# EAGLE design m2301-stereo-output (EAGLE 7.5.0)
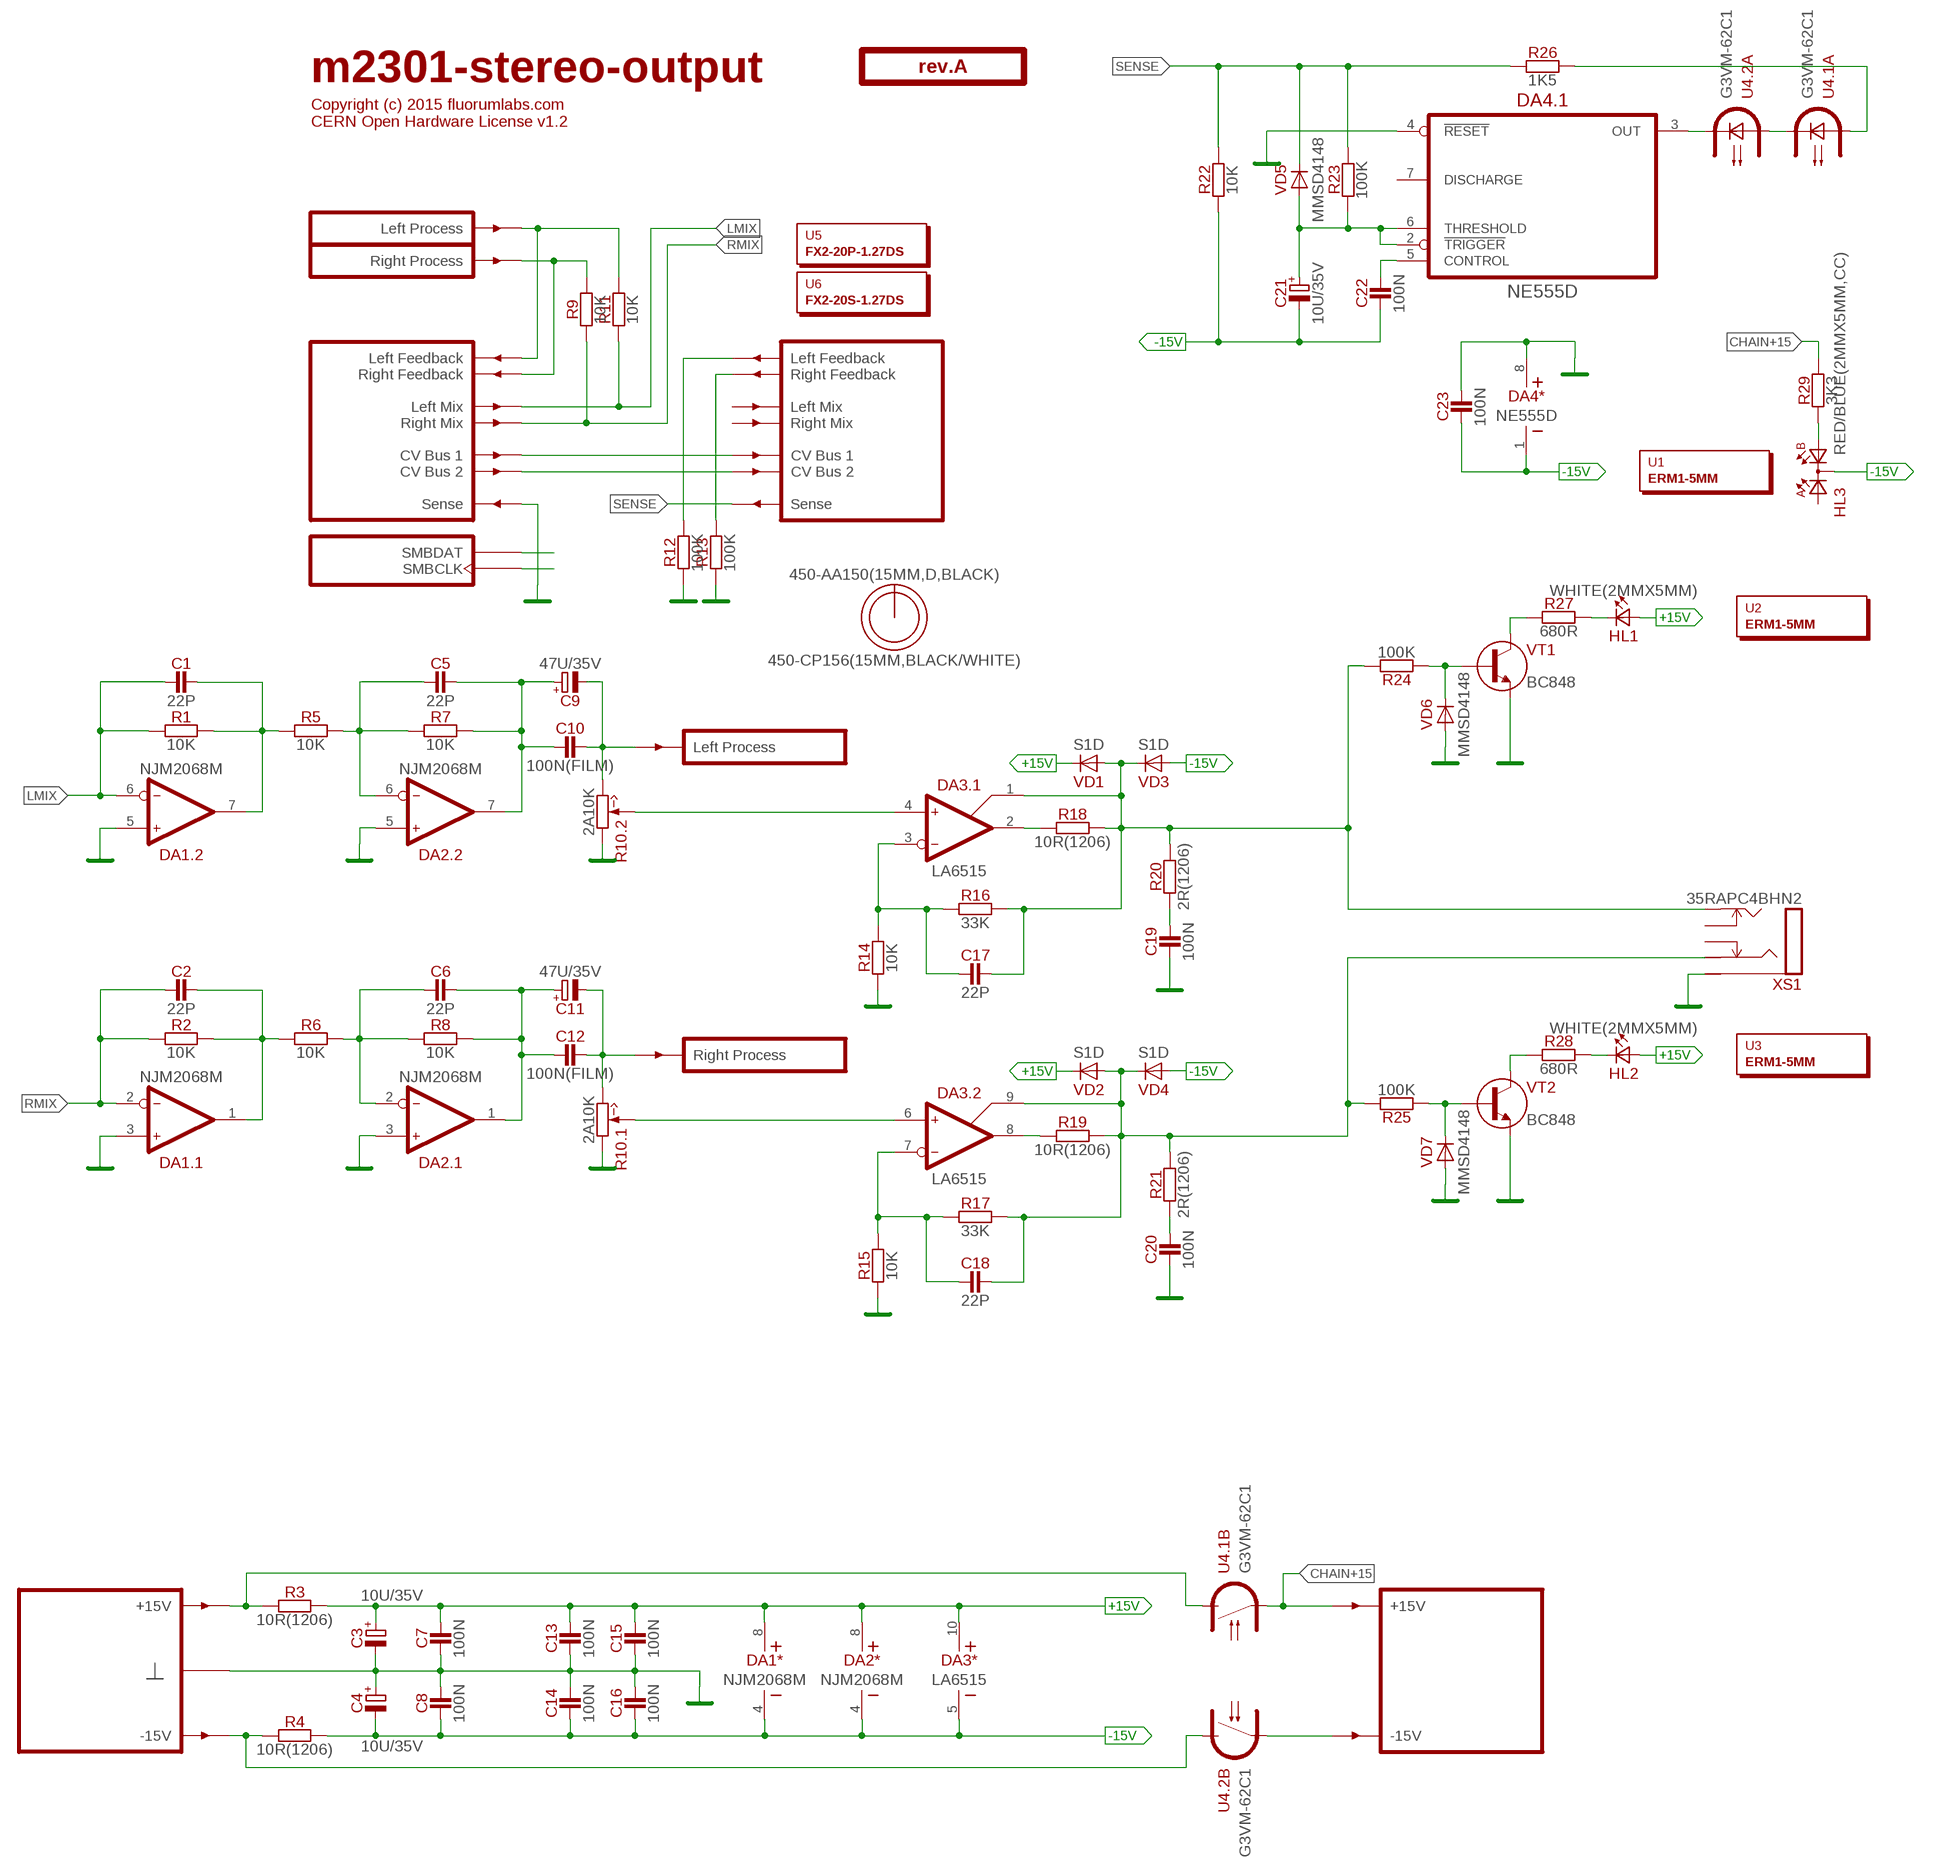
[diagram p0: schematic, sheet 1]

## Parts
C1  22P  [C-0805]
C2  22P  [C-0805]
C3  10U/35V  [E2-5]
C4  10U/35V  [E2-5]
C5  22P  [C-0805]
C6  22P  [C-0805]
C7  100N  [C-0805]
C8  100N  [C-0805]
C9  47U/35V  [E3,5-8]
C10  100N(FILM)  [C050-025X075]
C11  47U/35V  [E3,5-8]
C12  100N(FILM)  [C050-025X075]
C13  100N  [C-0805]
C14  100N  [C-0805]
C15  100N  [C-0805]
C16  100N  [C-0805]
C17  22P  [C-0805]
C18  22P  [C-0805]
C19  100N  [C-0805]
C20  100N  [C-0805]
C21  10U/35V  [E2-5]
C22  100N  [C-0805]
C23  100N  [C-0805]
DA1  NJM2068M  [SO-8]
DA2  NJM2068M  [SO-8]
DA3  LA6515  [SIL10]
DA4  NE555D  [SO-8]
HL1  WHITE(2MMX5MM)  [LED2X5]
HL2  WHITE(2MMX5MM)  [LED2X5]
HL3  RED/BLUE(2MMX5MM,CC)  [LED2X5-3PIN]
O1  TITLE  [EMPTY]
O2  450-AA150(15MM,D,BLACK)  [EMPTY]
O3  450-CP156(15MM,BLACK/WHITE)  [EMPTY]
PCB1  rev.A  ST2-BOARD-50-CHAIN  [ST2-BOARD-50]
R1  10K  [R-0805]
R2  10K  [R-0805]
R3  10R(1206)  [R-1206]
R4  10R(1206)  [R-1206]
R5  10K  [R-0805]
R6  10K  [R-0805]
R7  10K  [R-0805]
R8  10K  [R-0805]
R9  10K  [R-0805]
R10  2A10K  [RV11-DUAL]
R11  10K  [R-0805]
R12  100K  [R-0805]
R13  100K  [R-0805]
R14  10K  [R-0805]
R15  10K  [R-0805]
R16  33K  [R-0805]
R17  33K  [R-0805]
R18  10R(1206)  [R-1206]
R19  10R(1206)  [R-1206]
R20  2R(1206)  [R-1206]
R21  2R(1206)  [R-1206]
R22  10K  [R-0805]
R23  100K  [R-0805]
R24  100K  [R-0805]
R25  100K  [R-0805]
R26  1K5  [R-0805]
R27  680R  [R-0805]
R28  680R  [R-0805]
R29  3K3  [R-0805]
U1  ERM1-5MM  [EMPTY]
U2  ERM1-5MM  [EMPTY]
U3  ERM1-5MM  [EMPTY]
U4  G3VM-62C1  [DIL08]
U5  FX2-20P-1.27DS  [EMPTY]
U6  FX2-20S-1.27DS  [EMPTY]
VD1  S1D  [DO214AC]
VD2  S1D  [DO214AC]
VD3  S1D  [DO214AC]
VD4  S1D  [DO214AC]
VD5  MMSD4148  [SOD123]
VD6  MMSD4148  [SOD123]
VD7  MMSD4148  [SOD123]
VT1  BC848  [SOT23]
VT2  BC848  [SOT23]
XS1  35RAPC4BHN2  [35RAP]

## Nets
+15V [power]: C3.+ C7.2 C13.2 C15.2 DA1.8(*:V+) DA2.8(*:V+) DA3.10(*:V+) HL1.A HL2.A R3.2 VD1.C VD2.C
-15V: C4.- C8.1 C14.1 C16.1 C21.- C22.1 C23.1 DA1.4(*:V-) DA2.4(*:V-) DA3.5(*:V-) DA4.1(*:V-) HL3.K R4.2 R22.1 VD3.A VD4.A
CHAIN+15: PCB1.A+15'(P+15V) PCB1.B+15'(P+15V) R29.2 U4.7(.1B:S2)
GND: C3.- C4.+ C7.1 C8.2 C13.1 C14.2 C15.1 C16.2 C19.1 C20.1 C23.2 DA1.3(.1:IN+) DA1.5(.2:IN+) DA2.3(.1:IN+) DA2.5(.2:IN+) DA4.4(.1:!RESET) DA4.8(*:V+) PCB1.B4'(GND) PCB1.B4(GND) PCB1.B5'(GND) PCB1.B5(GND) PCB1.B6'(GND) PCB1.B6(GND) PCB1.B7'(GND) PCB1.B7(GND) PCB1.B8'(GND) PCB1.B8(GND) PCB1.BSENSE(SENSE) R10.1'(.2:CCW) R10.1(.1:CCW) R12.1 R13.1 R14.1 R15.1 VD6.A VD7.A VT1.2(E) VT2.2(E) XS1.1(S)
LMIX: C1.1 DA1.6(.2:IN-) PCB1.ALMIX(LMIX) R1.1 R11.1
N$1: PCB1.A+15(P+15V) PCB1.B+15(P+15V) R3.1 U4.8(.1B:S1)
N$2: PCB1.ARFBK'(RFBK') R13.2
N$3: DA3.6(.2:IN+) R10.2(.1:W)
N$4: PCB1.ALFBK'(LFBK') R12.2
N$5: PCB1.A-15(P-15V) PCB1.B-15(P-15V) R4.1 U4.6(.2B:S1)
N$7: C1.2 DA1.7(.2:OUT) R1.2 R5.1
N$8: C2.2 DA1.1(.1:OUT) R2.2 R6.1
N$9: DA3.4(.1:IN+) R10.2'(.2:W)
N$10: C11.- C12.2 PCB1.BOUTR'(OUTR) R10.3(.1:CW)
N$11: C17.2 DA3.1(.1:SENSE) R16.2 R18.2 R20.2 R24.2 VD1.A VD3.C XS1.2(T)
N$12: C17.1 DA3.3(.1:IN-) R14.2 R16.1
N$14: DA3.2(.1:OUT) R18.1
N$15: C9.- C10.2 PCB1.BOUTL'(OUTL) R10.3'(.2:CW)
N$16: C19.2 R20.1
N$22: C18.1 DA3.7(.2:IN-) R15.2 R17.1
N$24: C18.2 DA3.9(.2:SENSE) R17.2 R19.2 R21.2 R25.2 VD2.A VD4.C XS1.3(R)
N$27: C22.2 DA4.5(.1:CONTROL)
N$28: C21.+ DA4.2(.1:!TRIGGER) DA4.6(.1:THRESHOLD) R23.1 VD5.A
N$29: R26.2 U4.1(.1A:A)
N$30: R25.1 VD7.C VT2.1(B)
N$31: DA4.3(.1:OUT) U4.4(.2A:C)
N$32: R28.1 VT2.3(C)
N$33: HL2.K(C) R28.2
N$34: R24.1 VD6.C VT1.1(B)
N$35: R27.1 VT1.3(C)
N$36: U4.2(.1A:C) U4.3(.2A:A)
N$37: HL1.K(C) R27.2
N$38: PCB1.ASMBDAT'(SMBDAT) PCB1.ASMBDAT(SMBDAT)
N$39: PCB1.ARFBK(RFBK) PCB1.BINR(INR) R9.2
N$40: PCB1.ALFBK(LFBK) PCB1.BINL(INL) R11.2
N$41: PCB1.ACV1'(CV1') PCB1.ACV1(CV1)
N$42: PCB1.ACV2'(CV2') PCB1.ACV2(CV2)
N$43: PCB1.ASMBCLK'(SMBCLK) PCB1.ASMBCLK(SMBCLK)
N$44: HL3.A2 R29.1
N$45: DA3.8(.2:OUT) R19.1
N$46: C20.2 R21.1
N$51: PCB1.A-15'(P-15V) PCB1.B-15'(P-15V) U4.5(.2B:S2)
N$54: C5.1 DA2.6(.2:IN-) R5.2 R7.1
N$55: C5.2 C9.+ C10.1 DA2.7(.2:OUT) R7.2
N$56: C6.1 DA2.2(.1:IN-) R6.2 R8.1
N$57: C6.2 C11.+ C12.1 DA2.1(.1:OUT) R8.2
RMIX: C2.1 DA1.2(.1:IN-) PCB1.ARMIX(RMIX) R2.1 R9.1
SENSE: PCB1.BSENSE'(SENSE') R22.2 R23.2 R26.1 VD5.C
Unconnected: DA4.7(.1:DISCHARGE) HL3.A1 PCB1.ALMIX'(LMIX') PCB1.ARMIX'(RMIX') XS1.10(TN) XS1.11(RN)

## Library data of the parts
C1 C2 C5 C6 C17 C18 = capacitors:?; MOUSER: 77-VJ0805A220GXACBC
C3 C4 C21 = capacitors-electrolytic:?; MOUSER: 647-USW1V100MDD
C7 C8 C13-C16 C19 C20 C22 C23 = capacitors:?; MOUSER: 77-VJ0805V104MXBPBC
C9 C11 = capacitors-electrolytic:?; MOUSER: 647-USP1E470MDD
C10 C12 = capacitors:?; MOUSER: 505-MKS2.1/63/5
DA1 DA2 = ic-jrc:NJM2068; MOUSER: 513-NJM2068M
DA3 = ic-sanyo:LA6515
DA4 = ic-logic:NE555?; MOUSER: 595-NE555D
HL1 HL2 = optoelectronics:?(2MMX5MM)
HL3 = optoelectronics:?(2MMX5MM,CC)
O1 = text:TITLE
O2 = hardware:450-AA?; MOUSER: 450-AA150
O3 = hardware:450-C?; MOUSER: 450-CP156
PCB1 = module-footprints:ST2-BOARD-50-CHAIN
R1 R2 R5-R9 R11 R14 R15 R22 = resistors:?; MOUSER: 660-RK73H2ATTD1002F
R3 R4 R18 R19 = resistors:?; MOUSER: 660-RK73H2BTTD10R0F
R10 = potentiometers:2**?; MOUSER: 688-RK12L12C0A0E
R12 R13 R23-R25 = resistors:?; MOUSER: 660-RK73H2ATTD1003F
R16 R17 = resistors:?; MOUSER: 660-RK73H2ATTD3302F
R20 R21 = resistors:?; MOUSER: 660-RK73H2BTTD2R00F
R26 = resistors:?; MOUSER: 660-RK73H2ATTD1501F
R27 R28 = resistors:?; MOUSER: 660-RK73H2ATTD6800F
R29 = resistors:?; MOUSER: 660-RK73H2ATTD3301F
U1-U3 = hardware:?
U4 = optoelectronics:G3VM-?2C; MOUSER: 653-G3VM-62C1
U5 = hardware:?; MOUSER: 798-FX2-20P-1.27DS71
U6 = hardware:?; MOUSER: 798-FX2-20S-1.27DS71
VD1-VD4 = diodes:?; MOUSER: 625-S1DHE3
VD5-VD7 = diodes:?; MOUSER: 78-1N4148WFL-G3-08
VT1 VT2 = transistors-npn:?; MOUSER: 863-BC848BLT3G
XS1 = connectors:35RAPC4BHN2; MOUSER: 502-35RAPC4BHN2

## Board
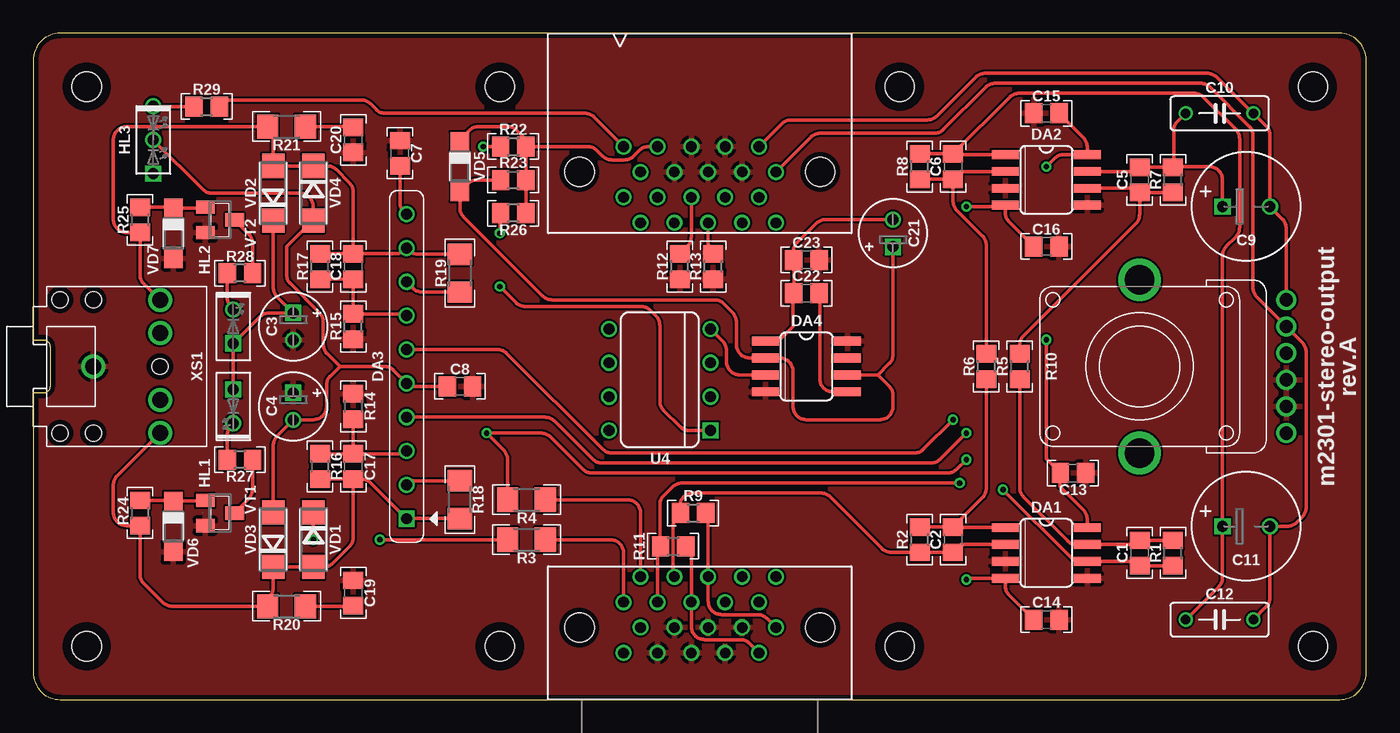
[diagram p1: board, top side]
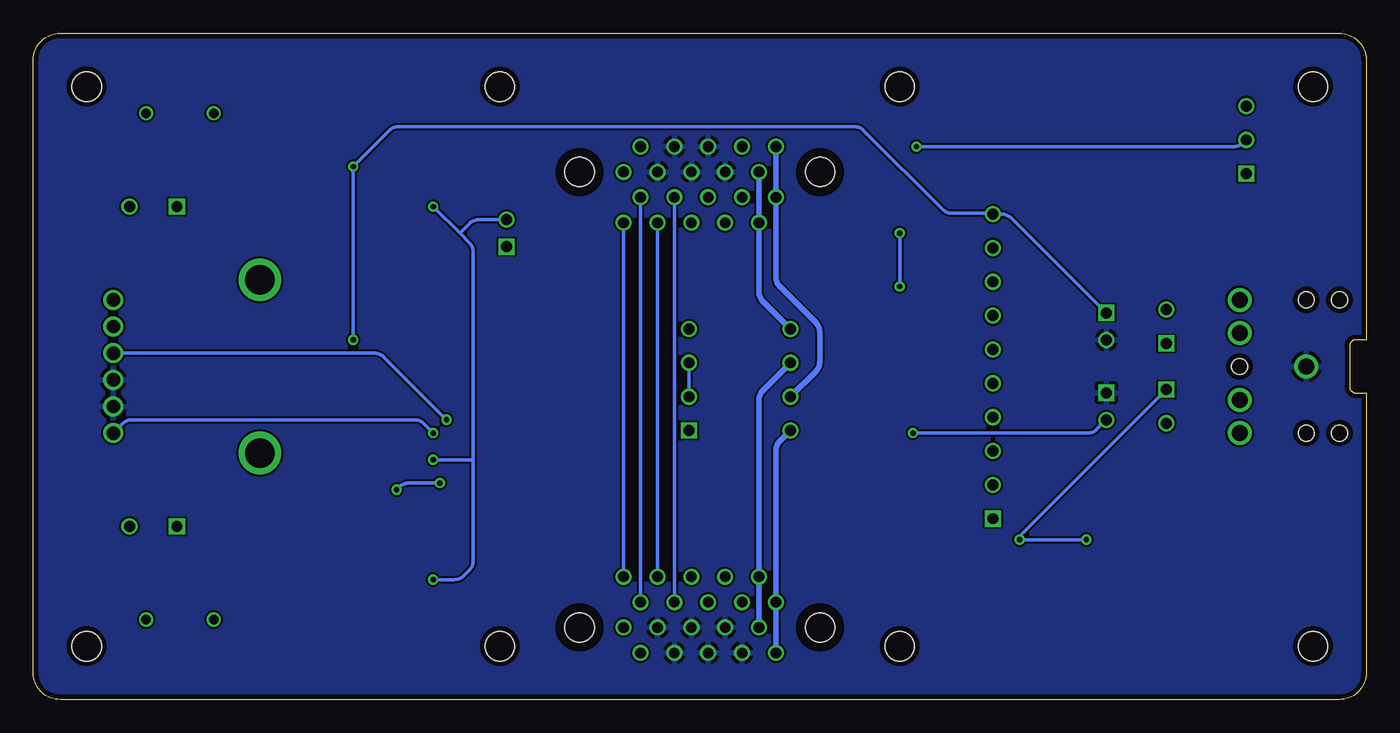
[diagram p2: board, bottom side, seen from below]

Size 100 x 50 mm. Coordinates in mm from the lower left corner, seen from the top.
Outline: 2,0 98,0 arc90 100,2 100,48 arc90 98,50 2,50 arc90 0,48 0,27 0.75,27 arc-90 1.25,26.5 1.25,23.5 arc-90 0.75,23 0,23 0,2 arc90 2,0
Copper layers (1*16): Top 0.0356mm / dielectric 1.5011mm / Bottom 0.0356mm
Design rules "LaenPCBOrder": minimum track width 6mil, minimum drill 13mil, track to track 6mil, track to pad 6mil, pad to pad 6mil, via to via 6mil, smd to smd 6mil, copper to edge 15mil, drill to drill 6mil, minimum pad ring 7mil, minimum via ring 7mil, stop-mask expansion 3mil, vias tented up to drill 0mil, thermal gap 10mil

### Footprints (pad centres in the part's own frame; a part is rotated, then mirrored left to right if it is on the bottom)
C-0805 = smd 1.3 x 1.5: 1 -0.95,0; 2 0.95,0
E2-5 = drill 0.813 square: + -1.016,0 | drill 0.813: - 1.016,0
E3,5-8 = drill 0.813 square: + -1.778,0 | drill 0.813: - 1.778,0
C050-025X075 = drill 0.7: 1 -2.54,0; 2 2.54,0
SO-8 = smd 0.66 x 2.032: 1 -1.905,-3.073; 2 -0.635,-3.073; 3 0.635,-3.073; 4 1.905,-3.073; 5 1.905,3.073; 6 0.635,3.073; 7 -0.635,3.073; 8 -1.905,3.073
SIL10 = drill 0.813 square: 1 -11.43,0 | drill 0.813: 2 -8.89,0; 3 -6.35,0; 4 -3.81,0; 5 -1.27,0; 6 1.27,0; 7 3.81,0; 8 6.35,0; 9 8.89,0; 10 11.43,0
LED2X5 = drill 0.813 square: A -1.27,0 | drill 0.813: K 1.27,0
LED2X5-3PIN = drill 0.813 square: A1 -2.54,0 | drill 0.813: A2 2.54,0; K 0,0
ST2-BOARD-50 = drill 0.8: A+15 44.285,7.31; A+15' 44.285,37.69; A-15 45.555,9.215; A-15' 45.555,35.785; ACV1 51.905,7.31; ACV1' 51.905,37.69; ACV2 53.175,9.215; ACV2' 53.175,35.785; ALFBK 49.365,7.31; ALFBK' 49.365,37.69; ALMIX 46.825,7.31; ALMIX' 46.825,37.69; ARFBK 50.635,9.215; ARFBK' 50.635,35.785; ARMIX 48.095,9.215; ARMIX' 48.095,35.785; ASMBCLK 55.715,9.215; ASMBCLK' 55.715,35.785; ASMBDAT 54.445,7.31; ASMBDAT' 54.445,37.69; B4 48.095,5.405; B4' 48.095,39.595; B5 49.365,3.5; B5' 49.365,41.5; B6 50.635,5.405; B6' 50.635,39.595; B7 51.905,3.5; B7' 51.905,41.5; B8 53.175,5.405; B8' 53.175,39.595; B+15 44.285,3.5; B+15' 44.285,41.5; B-15 45.555,5.405; B-15' 45.555,39.595; BINL 54.445,3.5; BINR 55.715,5.405; BOUTL' 54.445,41.5; BOUTR' 55.715,39.595; BSENSE 46.825,3.5; BSENSE' 46.825,41.5 | hole 2.2: 4,4; 4,46; 96,4; 96,46; 35,46; 65,46; 65,4; 35,4; 59.025,5.405; 40.975,5.405; 40.975,39.595; 59.025,39.595
R-0805 = smd 1.3 x 1.5: 1 -0.95,0; 2 0.95,0
R-1206 = smd 1.6 x 1.803: 1 -1.422,0; 2 1.422,0
RV11-DUAL = drill 1: 1 -1,-11; 1' -3,-11; 2 1,-11; 2' -5,-11; 3 3,-11; 3' 5,-11 | drill 2.2: S1 -6.5,0; S2 6.5,0
DIL08 = drill 0.813 square: 1 -3.81,-3.81 | drill 0.813: 2 -1.27,-3.81; 3 1.27,-3.81; 4 3.81,-3.81; 5 3.81,3.81; 6 1.27,3.81; 7 -1.27,3.81; 8 -3.81,3.81
DO214AC = smd 1.8 x 1.7: A 2.05,0; C -2.05,0
SOD123 = smd 1.4 x 1.4: A 1.9,0; C -1.9,0
SOT23 = smd 1 x 1.4: 1 -0.95,-1.1; 2 0.95,-1.1; 3 0,1.1
35RAP = drill 1.2: 1 4.5,0; 2 9.5,-5; 3 9.5,5; 10 9.5,-2.5; 11 9.5,2.5 | hole 1.2: 2,5; 2,-5; 4.5,5; 4.5,-5; 9.5,0

### Placement (x,y rotation side)
C1  83,11 90 top
C2  69,12 90 top
C3  19.5,28 270 top
C4  19.5,22 270 top
C5  83,39 90 top
C6  69,40 90 top
C7  27.5,41 270 top
C8  32,23.5 0 top
C9  91,37 0 top
C10  89,44 0 top
C11  91,13 0 top
C12  89,6 0 top
C13  78,17 180 top
C14  76,6 0 top
C15  76,44 0 top
C16  76,34 0 top
C17  24,17.5 270 top
C18  24,32.5 90 top
C19  24,8 270 top
C20  24,42 90 top
C21  64.5,35 90 top
C22  58,30.5 0 top
C23  58,33 0 top
DA1  76,11 270 top
DA2  76,39 270 top
DA3  28,25 90 top
DA4  58,25 270 top
HL1  15,22 270 top
HL2  15,28 90 top
HL3  9,42 90 top
O1  -85.09,99.06 0 top  (outside the outline)
O2  -87.63,99.06 0 top  (outside the outline)
O3  -90.17,99.06 0 top  (outside the outline)
PCB1  0,0 0 top
R1  85.5,11 90 top
R2  66.5,12 90 top
R3  37,12 180 top
R4  37,15 180 top
R5  74,25 90 top
R6  71.5,25 90 top
R7  85.5,39 90 top
R8  66.5,40 90 top
R9  49.5,14 0 top
R10  2*A10K  [RV11-DUAL]  83,25 90 top
R11  48,11.5 0 top
R12  48.5,32.5 90 top
R13  51,32.5 90 top
R14  24,22 270 top
R15  24,28 90 top
R16  21.5,17.5 270 top
R17  21.5,32.5 90 top
R18  32,15 270 top
R19  32,32 90 top
R20  19,7 180 top
R21  19,43 180 top
R22  36,41.5 0 top
R23  36,39 0 top
R24  8,14 270 top
R25  8,36 270 top
R26  36,36.5 180 top
R27  15.5,18 180 top
R28  15.5,32 180 top
R29  13,44.5 0 top
U1  -96,-14 0 top  (outside the outline)
U2  -92.71,99.06 0 top  (outside the outline)
U3  -95.25,99.06 0 top  (outside the outline)
U4  47,24 90 top
U5  -97,-16 0 top  (outside the outline)
U6  -98,-18 0 top  (outside the outline)
VD1  21,12 270 top
VD2  18,38 90 top
VD3  18,12 90 top
VD4  21,38 270 top
VD5  32,40 270 top
VD6  10.5,13 270 top
VD7  10.5,35 270 top
VT1  14,14 270 top
VT2  14,36 270 top
XS1  0,25 0 top

### Tracks (layer width: path | path; a pad name or v marks a point on that pad's centre or on a via)
+15V  (via drill 0.4)
  Top 0.254: C15.2 78.78,42.17 arc-45 79.07,41.46 DA2.8 77.32,40.91 arc45 76.61,40.61 v76,40 | DA1.8 79.07,13.51 arc45 78.78,14.22 77,16 77,16.95 C13.2 76,18.05 v76,27 | C7.2 27.5,37.34 arc45 27.79,36.64 DA3.10 | HL1.A HL2.A 16.99,28.72 arc-45 17.7,29.02 C3.+ 18.29,30.22 arc-45 18,30.93 VD2.C | R3.2 v26,12 | VD1.C v21,12
  Bottom 0.254: HL1.A 25.81,12.46 arc-45 v26,12 v21,12 | C3.+ 26.62,36.14 arc-45 27.33,36.43 DA3.10 28.07,36.5 31.09,36.5 arc45 31.79,36.79 37.71,42.71 arc-45 38.41,43 72.59,43 arc-45 73.29,42.71 v76,40 v76,27
-15V  (via drill 0.4)
  Top 0.254: C16.1 73.22,35.83 arc-45 72.93,36.54 DA2.4 72.83,37 v70,37 | C14.1 73.22,7.83 arc-45 72.93,8.54 DA1.4 70.09,9.1 v70,9 | C8.1 28.23,23.5 DA3.5 28,23.75 27.04,24.71 arc45 26.34,25 23,25 | DA4.1 55.91,26.91 57,28 57,30.45 C22.1 C23.1 57,33.05 57,33.59 arc-45 57.29,34.29 58.72,35.72 arc-45 59.43,36.02 C21.- | VD3.A 18,19.07 arc-45 18.29,19.78 C4.- 19.52,21 21,21 arc90 22,22 22,23.59 arc-45 22.29,24.29 23,25 | R4.2 35.58,18.01 arc45 35.28,18.71 v34,20 38.09,20 arc-45 38.79,19.71 41.21,17.29 arc45 41.91,17 68.59,17 arc45 69.29,17.29 v70,18 | 23,25 22.04,25.96 arc-45 21.75,26.66 21.75,28.34 arc45 21.46,29.04 19.29,31.21 arc-45 19,31.91 19,34 20.95,35.95 VD4.A 21,37 arc90 20,38 13.41,38 arc-45 12.71,38.29 HL3.K | R22.1 v33.75,41.5
  Bottom 0.254: v34,20 20.9,20 arc-45 20.19,20.29 C4.- | v33.75,41.5 9.91,41.5 arc-45 9.21,41.79 HL3.K | v70,9 68.41,9 arc-45 67.71,9.29 67.29,9.71 arc-45 67,10.41 67,18 | 67,18 67,33.59 arc-45 67.29,34.29 68,35 | 68,35 v70,37 | v70,18 67,18 | C21.- 66.57,36.02 arc-45 67.28,35.72 68,35
CHAIN+15
  Top 0.254: R29.2 14,44.5 14.21,44.71 arc-45 14.91,45 24.59,45 arc-45 25.29,44.71 25.71,44.29 arc45 26.41,44 41.37,44 arc-45 42.08,43.71 PCB1.B+15'
  Bottom 0.406: PCB1.B+15' PCB1.A+15' 44.28,31.7 arc-45 43.99,30.99 41.29,28.29 arc45 41,27.59 41,25.33 arc45 41.29,24.63 U4.7
GND
  pour Bottom: 0,50 98,50 arc-90 100,48 100,0 2,0 arc-90 0,2
  pour Top: 0,50 98,50 arc-90 100,48 100,0 2,0 arc-90 0,2
LMIX  (via drill 0.4)
  Top 0.254: PCB1.ALMIX 46.83,11.28 R11.1 47,11.55 47,14.59 arc-45 47.29,15.29 47.96,15.96 arc-45 48.66,16.25 v69.5,16.25 | R1.1 C1.1 82.69,10.37 DA1.6 78.55,10.37 arc-45 77.84,10.66 v72.75,15.75
  Bottom 0.254: v69.5,16.25 71.84,16.25 arc-45 72.54,15.96 v72.75,15.75
N$1
  Top 0.254: R3.1 43.28,12 arc-90 44.28,11 PCB1.A+15
  Bottom 0.406: PCB1.B+15 PCB1.A+15 44.28,18.68 arc45 43.99,19.39 U4.8
N$2
  Top 0.254: PCB1.ARFBK' 50.63,34.23 arc45 50.93,33.52 R13.2
N$3  (via drill 0.4)
  Top 0.254: DA3.6 34.82,26.27 arc-45 35.52,25.98 42.71,18.79 arc45 43.41,18.5 66.09,18.5 arc45 66.79,18.79 v69,21
  Bottom 0.254: v69,21 73.71,25.71 arc-45 74.41,26 R10.2
N$4
  Top 0.254: PCB1.ALFBK' 49.37,34.73 arc-45 49.07,34.02 R12.2
N$5
  Top 0.254: R4.1 44.55,15 arc-90 45.55,14 PCB1.A-15
  Bottom 0.406: PCB1.B-15 PCB1.A-15 45.55,22.49 arc45 45.26,23.2 U4.6
N$7
  Top 0.254: R1.2 C1.2 82.69,11.63 DA1.7 78.28,11.63 arc-45 77.57,11.93 74.29,15.21 arc-45 74,15.91 R5.1
N$8
  Top 0.254: DA1.1 69.05,12.9 C2.2 | C2.2 R2.2 | R6.1 71.5,15.86 arc-45 71.21,15.16 C2.2
N$9  (via drill 0.4)
  Top 0.254: DA3.4 38.4,21.19 arc-45 39.1,20.9 41.96,18.04 arc45 42.66,17.75 67.34,17.75 arc45 68.04,18.04 v70,20
  Bottom 0.254: v70,20 70.71,20.71 arc-45 71.41,21 92.59,21 arc-45 93.29,20.71 R10.2'
N$10
  Top 0.254: C12.2 92.48,6.95 arc45 92.78,7.65 C11.- 94.09,13 arc45 94.79,13.29 95.21,13.71 arc45 95.5,14.41 95.5,26.09 arc45 95.21,26.79 R10.3 91.79,30.21 arc-45 91.5,30.91 91.5,42.34 arc45 91.21,43.04 88.29,45.96 arc45 87.59,46.25 72.16,46.25 arc45 71.46,45.96 68.29,42.79 arc-45 67.59,42.5 59.03,42.5 arc45 58.33,42.21 PCB1.BOUTR'
N$11
  Top 0.254: XS1.2 6.29,16.79 arc45 6,16.09 6,14.05 arc90 7,13.05 R24.2 8,9.41 arc45 8.29,8.71 9.71,7.29 arc45 10.41,7 17,7 | 17,7 R20.2 | 17,7 17.71,7.71 arc45 18,8.41 VD3.C VD1.A 21.79,9.95 arc45 22.49,10.24 23.71,11.46 arc45 24,12.16 C17.2 | R18.2 DA3.1 25.31,16.26 arc45 24.61,16.55 C17.2 | R16.2 C17.2
N$12
  Top 0.254: R16.1 C17.1 | C17.1 R14.2 | C17.1 27.52,18.45 arc45 DA3.3
N$14
  Top 0.254: R18.1 28.31,16.42 DA3.2
N$15
  Top 0.254: R10.3' 94,35.36 arc45 93.71,36.07 C9.- 92.78,42.35 arc45 92.48,43.05 C10.2 91.54,43.96 88.79,46.71 arc45 88.09,47 71.41,47 arc45 70.71,46.71 67.79,43.79 arc-45 67.09,43.5 56.86,43.5 arc45 56.15,43.21 PCB1.BOUTL'
N$16
  Top 0.254: R20.1 23.88,7 arc45 C19.2
N$22
  Top 0.254: R17.1 C18.1 R15.2 27.66,28.95 arc-45 DA3.7
N$24
  Top 0.254: XS1.3 8.29,31.21 arc-45 8,31.91 R25.2 7,35.05 arc-90 6,36.05 6,42 arc-90 7,43 R21.2 18,42.58 VD2.A VD4.C 22.04,40.05 arc-45 22.74,39.76 23.71,38.79 arc-45 24,38.09 C18.2 | R19.2 28.88,33.42 arc-45 28.18,33.72 DA3.9 27.85,33.74 arc-45 27.15,33.45 C18.2 | R17.2 C18.2
N$27
  Top 0.254: DA4.5 60,23.09 arc-90 59,24.09 59,30.45 C22.2
N$28
  Top 0.254: R23.1 33.31,39 arc45 32.61,38.71 VD5.A 32,36.91 arc45 32.29,36.21 38.21,30.29 arc45 38.91,30 51.09,30 arc-45 51.79,29.71 52.46,29.04 arc-45 52.75,28.34 52.75,26.64 arc90 53.75,25.64 DA4.2 56,25.64 arc-90 57,24.64 57,22 arc90 58,21 63.5,21 arc90 64.5,22 64.5,22.82 arc45 64.21,23.52 63.37,24.36 | DA4.6 63.37,24.36 | C21.+ 64.5,25.91 arc-45 64.21,25.21 63.37,24.36
N$29  (via drill 0.4)
  Top 0.254: U4.1 49.22,20.19 arc-45 48.52,20.48 47.29,21.71 arc-45 47,22.41 47,28.09 arc45 46.71,28.79 46.29,29.21 arc45 45.59,29.5 36.91,29.5 arc-45 36.21,29.79 v35,31 | v35,35 35,36.45 R26.2
  Bottom 0.254: v35,31 v35,35
N$30
  Top 0.254: R25.1 10.45,36.95 VD7.C 12.85,36.9 VT2.1
N$31
  Top 0.254: DA4.3 53,24.36 arc-90 52,25.36 52,26.21 arc45 51.71,26.91 U4.4
N$32
  Top 0.254: R28.1 16.45,34.24 arc45 16.16,34.94 VT2.3
N$33
  Top 0.254: R28.2 14.55,30.13 arc45 14.84,29.43 HL2.K
N$34
  Top 0.254: R24.1 10.45,14.95 VD6.C 12.85,14.9 VT1.1
N$35
  Top 0.254: R27.1 16.45,15.76 arc-45 16.16,15.06 VT1.3
N$36
  Bottom 0.254: U4.2 U4.3
N$37
  Top 0.254: R27.2 14.55,19.87 arc-45 14.84,20.57 HL1.K
N$38
  Bottom 0.254: PCB1.ASMBDAT PCB1.ASMBDAT'
N$39
  Top 0.254: R9.2 50.63,13.81 PCB1.ARFBK 50.63,7.38 arc90 51.63,6.38 54.33,6.38 arc-45 55.04,6.08 PCB1.BINR
N$40
  Top 0.254: R11.2 49.37,11.09 PCB1.ALFBK 49.37,5.5 arc90 50.37,4.5 53.03,4.5 arc-45 53.74,4.21 PCB1.BINL
N$41
  Bottom 0.254: PCB1.ACV1 PCB1.ACV1'
N$42
  Bottom 0.254: PCB1.ACV2 PCB1.ACV2'
N$43
  Bottom 0.254: PCB1.ASMBCLK PCB1.ASMBCLK'
N$44
  Top 0.254: R29.1 9.04,44.5 HL3.A2
N$45
  Top 0.254: R19.1 29.19,30.58 arc-45 28.48,30.87 DA3.8
N$46
  Top 0.254: R21.1 23.95,43 C20.2
N$51
  Bottom 0.406: PCB1.B-15' PCB1.A-15' 45.55,30.59 arc-45 45.26,29.88 U4.5
N$54
  Top 0.254: DA2.6 82.69,38.37 C5.1 | C5.1 R7.1 | R5.2 74,26.59 arc-45 74.29,27.29 82.71,35.71 arc45 83,36.41 C5.1
N$55
  Top 0.254: DA2.7 82.69,39.63 C5.2 R7.2 85.55,40 | C9.+ 89.22,39 arc90 88.22,40 85.55,40 | 85.55,40 85.55,42.68 arc-45 85.84,43.38 C10.1
N$56
  Top 0.254: R8.1 C6.1 | DA2.2 69.58,39.63 C6.1 | R6.2 71.5,34.09 arc45 71.21,34.79 69.29,36.71 arc-45 69,37.41 C6.1
N$57
  Top 0.254: DA2.1 69.05,40.91 C6.2 | C6.2 R8.2 | C12.1 88.93,8.47 arc45 89.22,9.18 C11.+ 89.22,33.31 arc-45 89.52,34.02 90.21,34.71 arc45 90.5,35.41 90.5,42.09 arc45 90.21,42.79 87.79,45.21 arc45 87.09,45.5 73.96,45.5 arc45 73.26,45.21 C6.2
RMIX
  Top 0.254: DA1.2 69.58,11.63 C2.1 R2.1 64.36,11.05 arc-45 63.66,11.34 59.79,15.21 arc45 59.09,15.5 49.5,15.5 arc90 48.5,14.5 48.5,14.05 R9.1 48.29,13.74 arc45 48,13.04 48,9.5 48.09,9.4 PCB1.ARMIX
SENSE
  Top 0.254: VD5.C 32,42 32.71,42.71 arc-45 33.41,43 35.59,43 arc-45 36.29,42.71 37,42 | 37,42 37,41.55 R22.2 R23.2 R26.1 | PCB1.BSENSE' 46.16,41.5 arc45 45.46,41.21 45.04,40.79 arc-45 44.34,40.5 43.41,40.5 arc-45 42.71,40.79 42.29,41.21 arc45 41.59,41.5 37.5,41.5 37,42